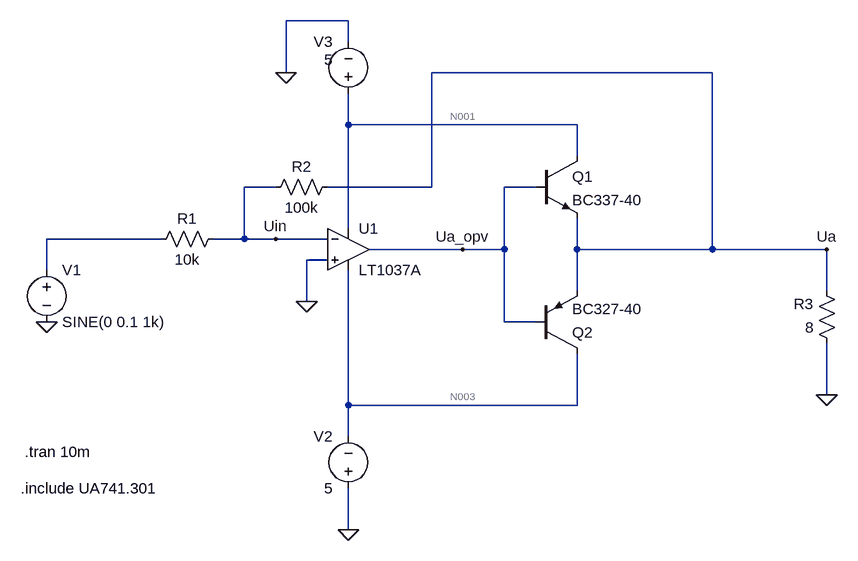
[diagram p0: schematic labor01_realerOPV.asc]
labor01_realerOPV.asc, the LTspice schematic file:
Version 4
SHEET 1 1368 708
WIRE -80 -96 -176 -96
WIRE -80 -64 -80 -96
WIRE -176 -16 -176 -96
WIRE 480 -16 48 -16
WIRE -80 64 -80 16
WIRE 272 64 -80 64
WIRE 272 112 272 64
WIRE -192 160 -240 160
WIRE 48 160 48 -16
WIRE 48 160 -112 160
WIRE 208 160 160 160
WIRE -80 224 -80 64
WIRE -368 240 -544 240
WIRE -240 240 -240 160
WIRE -240 240 -288 240
WIRE -192 240 -240 240
WIRE -112 240 -192 240
WIRE 96 256 -48 256
WIRE 160 256 160 160
WIRE 160 256 96 256
WIRE 272 256 272 208
WIRE 480 256 480 -16
WIRE 480 256 272 256
WIRE 656 256 480 256
WIRE -112 272 -144 272
WIRE -544 288 -544 240
WIRE 272 320 272 256
WIRE 656 320 656 256
WIRE -144 336 -144 272
WIRE 160 368 160 256
WIRE 208 368 160 368
WIRE 656 480 656 400
WIRE -80 496 -80 288
WIRE 272 496 272 416
WIRE 272 496 -80 496
WIRE -80 544 -80 496
WIRE -80 688 -80 624
FLAG 656 480 0
FLAG -544 368 0
FLAG -176 -16 0
FLAG -144 336 0
FLAG 656 256 Ua
FLAG 96 256 Ua_opv
FLAG -192 240 Uin
FLAG -80 688 0
SYMBOL voltage -544 272 R0
WINDOW 123 0 0 Left 0
WINDOW 39 0 0 Left 0
SYMATTR InstName V1
SYMATTR Value SINE(0 0.1 1k)
SYMBOL voltage -80 32 R180
WINDOW 0 24 96 Left 2
WINDOW 3 24 68 Left 2
WINDOW 123 0 0 Left 0
WINDOW 39 0 0 Left 0
SYMATTR InstName V3
SYMATTR Value 5
SYMBOL voltage -80 640 R180
WINDOW 0 24 96 Left 2
WINDOW 3 24 16 Left 2
WINDOW 123 0 0 Left 0
WINDOW 39 0 0 Left 0
SYMATTR InstName V2
SYMATTR Value 5
SYMBOL res -272 224 R90
WINDOW 0 0 56 VBottom 2
WINDOW 3 32 56 VTop 2
SYMATTR InstName R1
SYMATTR Value 10k
SYMBOL res -96 144 R90
WINDOW 0 0 56 VBottom 2
WINDOW 3 32 56 VTop 2
SYMATTR InstName R2
SYMATTR Value 100k
SYMBOL res 672 416 R180
WINDOW 0 36 76 Left 2
WINDOW 3 36 40 Left 2
SYMATTR InstName R3
SYMATTR Value 8
SYMBOL npn 208 112 R0
SYMATTR InstName Q1
SYMATTR Value BC337-40
SYMBOL pnp 208 416 M180
SYMATTR InstName Q2
SYMATTR Value BC327-40
SYMBOL OpAmps\\LT1037A -80 192 R0
SYMATTR InstName U1
TEXT -584 624 Left 2 !.include UA741.301
TEXT -578 568 Left 2 !.tran 10m

The netlist it stands for:
* labor01_realerOPV.asc
V1 N002 0 SINE(0 0.1 1k)
V3 N001 0 5
V2 0 N003 5
R1 Uin N002 10k
R2 Ua Uin 100k
R3 0 Ua 8
Q1 N001 Ua_opv Ua 0 BC337-40
Q2 N003 Ua_opv Ua 0 BC327-40
XU1 0 Uin N001 N003 Ua_opv LT1037A  ; pins In+ In- V+ V- OUT
.model NPN NPN
.model PNP PNP
.lib standard.bjt
.include UA741.301
.tran 10m
.backanno
.end

* Results of the author's LTspice run, read from the files saved beside the schematic
* Operating Point, zero values left out:
*   V(n001) = 5 V
*   V(n003) = -5 V
*   V(uin) = 8.405 µV
*   V(ua) = 8.069 mV
*   V(ua_opv) = 605.5 mV
*   Ic(Q2) = -5.912 pA
*   Ib(Q2) = 6.524 pA
*   Ic(Q1) = 1.006 mA
*   Ib(Q1) = 2.336 µA
*   Ie(Q1) = -1.009 mA
*   I(R3) = -1.009 mA
*   I(R2) = 80.61 nA
*   I(R1) = 840.5 pA
*   I(V2) = -562.3 µA
*   I(V3) = -1.569 mA
*   I(V1) = 840.5 pA
*   Ix(u1:1) = 79.75 nA
*   Ix(u1:2) = 79.77 nA
*   Ix(u1:3) = 562.2 µA
*   Ix(u1:4) = -562.3 µA
*   Ix(u1:5) = -2.337 µA
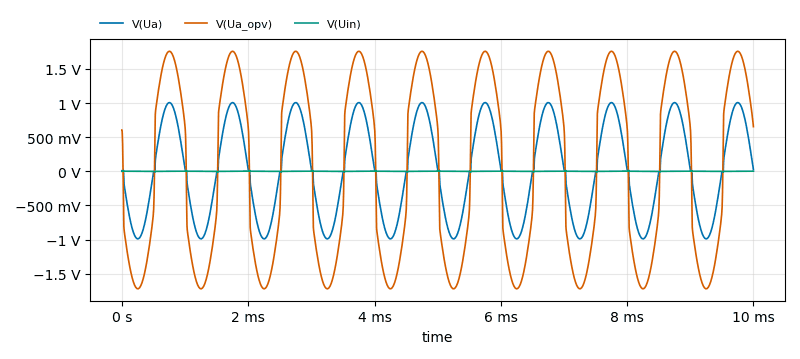
[diagram p1: Transient Analysis of labor01_realerOPV.asc, plotted from the saved traces]
* Transient Analysis, 1 run:
*   V(Ua): min -990.8 mV, max 1.007 V, average 8.087 mV, rms 705.8 mV, last 25.77 mV
*   V(Ua_opv): min -1.723 V, max 1.759 V, average 21.63 mV, rms 1.384 V, last 653.6 mV
*   V(Uin): min -13.08 mV, max 13.02 mV, average 10.05 µV, rms 2.091 mV, last 1.603 mV